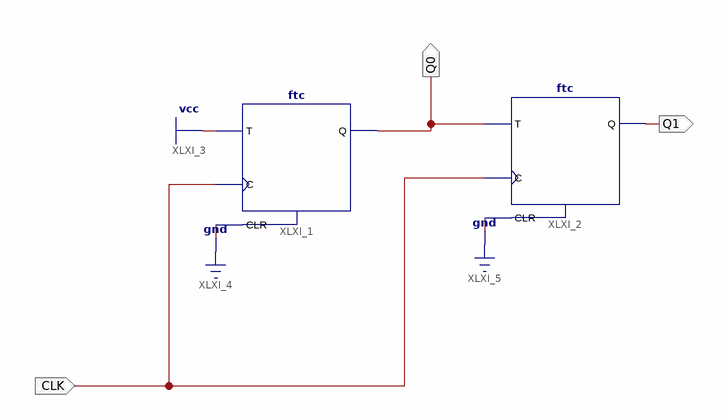
[diagram p0: schematic sheet 1]
// Xilinx ISE schematic countercommon.sch (spartan6) as structural Verilog: 2 symbols, 3 ports
module countercommon (
  input  CLK,
  output Q0,
  output Q1
);

  ftc XLXI_1 (.C(CLK), .CLR(1'b0), .T(1'b1), .Q(Q0));
  ftc XLXI_2 (.C(CLK), .CLR(1'b0), .T(Q0), .Q(Q1));
endmodule
